# EAGLE design v2.7_Schematic (EAGLE 9.4.2)
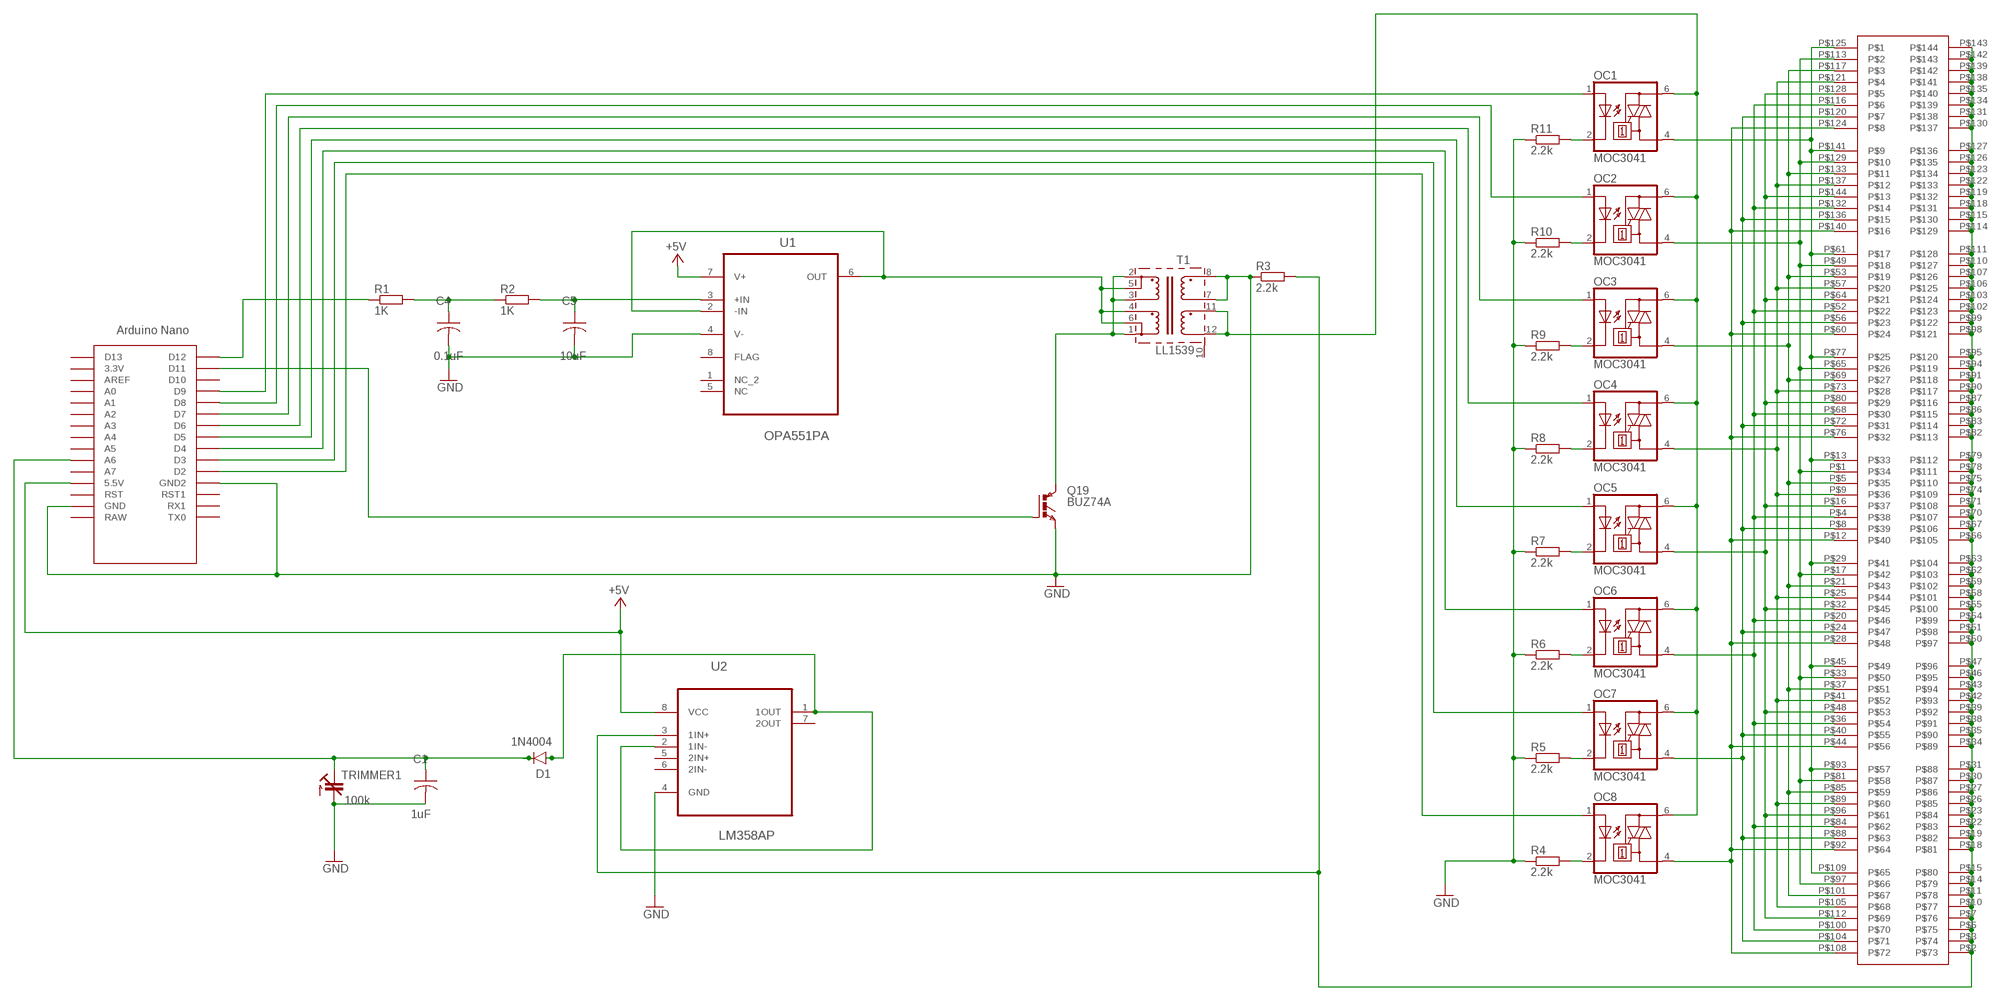
[diagram p0: schematic, sheet 1]

## Parts
C1  1uF  ECA-1HM100  [CAP_RADIAL_2MM]
C4  0.1uF  ECA-1HM100  [CAP_RADIAL_2MM]
C5  10uF  ECA-1HM100  [CAP_RADIAL_2MM]
D1  1N4004  [DO-41]
OC1  MOC3041  [DIL06]
OC2  MOC3041  [DIL06]
OC3  MOC3041  [DIL06]
OC4  MOC3041  [DIL06]
OC5  MOC3041  [DIL06]
OC6  MOC3041  [DIL06]
OC7  MOC3041  [DIL06]
OC8  MOC3041  [DIL06]
Q19  BUZ74A  IGBTTO220AV  [TO220AV]
R1  1K  R-EU_0204/2V  [0204V]
R2  1K  R-EU_0204/2V  [0204V]
R3  2.2k  R-EU_0204/2V  [0204V]
R4  2.2k  R-EU_0204/2V  [0204V]
R5  2.2k  R-EU_0204/2V  [0204V]
R6  2.2k  R-EU_0204/2V  [0204V]
R7  2.2k  R-EU_0204/2V  [0204V]
R8  2.2k  R-EU_0204/2V  [0204V]
R9  2.2k  R-EU_0204/2V  [0204V]
R10  2.2k  R-EU_0204/2V  [0204V]
R11  2.2k  R-EU_0204/2V  [0204V]
T1  LL1539  [LL1539]
TRIMMER1  100k  C-TRIMM3040.452  [CTRIM3040.452]
U1  OPA551PA  [DIP254P762X508-8]
U2  LM358AP  [DIP254P762X508-8]
U$1  NANO  [NANO]
U$2  DOTS_V2  [DOTS_V2]

## Nets
+5V: U1.7(V+) U2.8(VCC) U$1.5V(5.5V)
GND: C1.2 C4.2 C5.2 Q19.E R3.1 R4.1 R5.1 R6.1 R7.1 R8.1 R9.1 R10.1 R11.1 T1.7 T1.8 TRIMMER1.2(A) U1.4(V-) U2.4(GND) U$1.GND U$1.GND1(GND2)
N$1: OC7.2(C) R5.2
N$2: C4.1 R1.2 R2.1
N$3: C5.1 R2.2 U1.3(+IN)
N$4: T1.4 T1.5 T1.6 U1.2(-IN) U1.6(OUT)
N$5: Q19.C T1.1 T1.2 T1.3
N$6: Q19.G U$1.D11
N$7: D1.A U2.1(1OUT) U2.2(1IN-)
N$8: C1.1 D1.C TRIMMER1.1A(E) U$1.A6
N$9: OC8.1(A) U$1.D2
N$10: OC7.1(A) U$1.D3
N$11: OC2.1(A) U$1.D8
N$12: OC6.1(A) U$1.D4
N$13: R1.1 U$1.D12
N$14: OC5.1(A) U$1.D5
N$15: OC4.1(A) U$1.D6
N$16: OC3.1(A) U$1.D7
N$17: R3.2 U2.3(1IN+) U$2.P$2 U$2.P$3 U$2.P$6 U$2.P$7 U$2.P$10 U$2.P$11 U$2.P$14 U$2.P$15 U$2.P$18 U$2.P$19 U$2.P$22 U$2.P$23 U$2.P$26 U$2.P$27 U$2.P$30 U$2.P$31 U$2.P$34 U$2.P$35 U$2.P$38 U$2.P$39 U$2.P$42 U$2.P$43 U$2.P$46 U$2.P$47 U$2.P$50 U$2.P$51 U$2.P$54 U$2.P$55 U$2.P$58 U$2.P$59 U$2.P$62 U$2.P$63 U$2.P$66 U$2.P$67 U$2.P$70 U$2.P$71 U$2.P$74 U$2.P$75 U$2.P$78 U$2.P$79 U$2.P$82 U$2.P$83 U$2.P$86 U$2.P$87 U$2.P$90 U$2.P$91 U$2.P$94 U$2.P$95 U$2.P$98 U$2.P$99 U$2.P$102 U$2.P$103 U$2.P$106 U$2.P$107 U$2.P$110 U$2.P$111 U$2.P$114 U$2.P$115 U$2.P$118 U$2.P$119 U$2.P$122 U$2.P$123 U$2.P$126 U$2.P$127 U$2.P$130 U$2.P$131 U$2.P$134 U$2.P$135 U$2.P$138 U$2.P$139 U$2.P$142 U$2.P$143
N$18: OC1.6(A2) OC2.6(A2) OC3.6(A2) OC4.6(A2) OC5.6(A2) OC6.6(A2) OC7.6(A2) OC8.6(A2) T1.11 T1.12
N$19: OC4.4(A1) U$2.P$9 U$2.P$25 U$2.P$41 U$2.P$57 U$2.P$73 U$2.P$89 U$2.P$105 U$2.P$121 U$2.P$137
N$20: OC1.1(A) U$1.D9
N$21: OC2.4(A1) U$2.P$1 U$2.P$17 U$2.P$33 U$2.P$49 U$2.P$65 U$2.P$81 U$2.P$97 U$2.P$113 U$2.P$129
N$22: OC3.4(A1) U$2.P$5 U$2.P$21 U$2.P$37 U$2.P$53 U$2.P$69 U$2.P$85 U$2.P$101 U$2.P$117 U$2.P$133
N$23: OC5.4(A1) U$2.P$16 U$2.P$32 U$2.P$48 U$2.P$64 U$2.P$80 U$2.P$96 U$2.P$112 U$2.P$128 U$2.P$144
N$24: OC6.4(A1) U$2.P$4 U$2.P$20 U$2.P$36 U$2.P$52 U$2.P$68 U$2.P$84 U$2.P$100 U$2.P$116 U$2.P$132
N$25: OC7.4(A1) U$2.P$8 U$2.P$24 U$2.P$40 U$2.P$56 U$2.P$72 U$2.P$88 U$2.P$104 U$2.P$120 U$2.P$136
N$26: OC8.4(A1) U$2.P$12 U$2.P$28 U$2.P$44 U$2.P$60 U$2.P$76 U$2.P$92 U$2.P$108 U$2.P$124 U$2.P$140
N$27: OC8.2(C) R4.2
N$28: OC1.4(A1) U$2.P$13 U$2.P$29 U$2.P$45 U$2.P$61 U$2.P$77 U$2.P$93 U$2.P$109 U$2.P$125 U$2.P$141
N$29: OC6.2(C) R6.2
N$30: OC5.2(C) R7.2
N$31: OC4.2(C) R8.2
N$32: OC3.2(C) R9.2
N$33: OC2.2(C) R10.2
N$34: OC1.2(C) R11.2
Unconnected: T1.10 U1.1(NC_2) U1.5(NC) U1.8(FLAG) U2.5(2IN+) U2.6(2IN-) U2.7(2OUT) U$1.3.3V U$1.A0 U$1.A1 U$1.A2 U$1.A3 U$1.A4 U$1.A5 U$1.A7 U$1.AREF U$1.D10 U$1.D13 U$1.RAW U$1.RST U$1.RST1 U$1.RX1 U$1.TX0

## Library data of the parts
C1 C4 C5 = Resistor_Capacitor:ECA-1HM100: CAP ALUM 10UF 20% 50V RADIAL Manufacturer's datasheet <https://media.digikey.com/pdf/Data%20Sheets/Panasonic%20Electronic%20Components/ECA-xxM%20Series,TypeA.pdf>; CREATED_BY: PCBLayout.com; DIGIKEY_PART_NUMBER: P5178-ND; MANUFACTURER: Panasonic Electronic Components; MPN: ECA-1HM100; PACKAGE: CAP RADIAL 2MM LS
D1 = Diodes:1N4004: DIODE GEN PURP 400V 1A DO41 Manufacturer's datasheet <https://www.mccsemi.com/pdf/Products/1N4001-1N4007(DO-41).pdf>; CREATED_BY: PCBLayout.com; DIGIKEY_PART_NUMBER: 1N4004MSCT-ND; MANUFACTURER: Micro Commercial Co; MPN: 1N4004; PACKAGE: DO-41
OC1-OC8 = stepper_drivers_etc:MOC3041
Q19 = IGBT:IGBT: IGBT
R1-R11 = resistor:R-EU_: RESISTOR, European symbol
T1 = lundahl:LL1539: LL1539 Transformer
TRIMMER1 = resistor:C-TRIMM: Trimm capacitor
U1 = Texas Instruments_By_element14_Batch_1:OPA551PA: OPERATIONAL AMPLIFIER; MPN: OPA551PA; OC_FARNELL: 4427191; OC_NEWARK: 75C5068; PACKAGE: PDIP; SUPPLIER: Texas Instruments
U2 = Texas Instruments_By_element14_Batch_1:LM358AP: OPERATIONAL AMPLIFIER; MPN: LM358AP; OC_FARNELL: 1459520; OC_NEWARK: 67K0318; PACKAGE: PDIP; SUPPLIER: Texas Instruments
U$1 = Arduino-clone:NANO: Arduino Nano
U$2 = Library:DOTS_V2

## Board
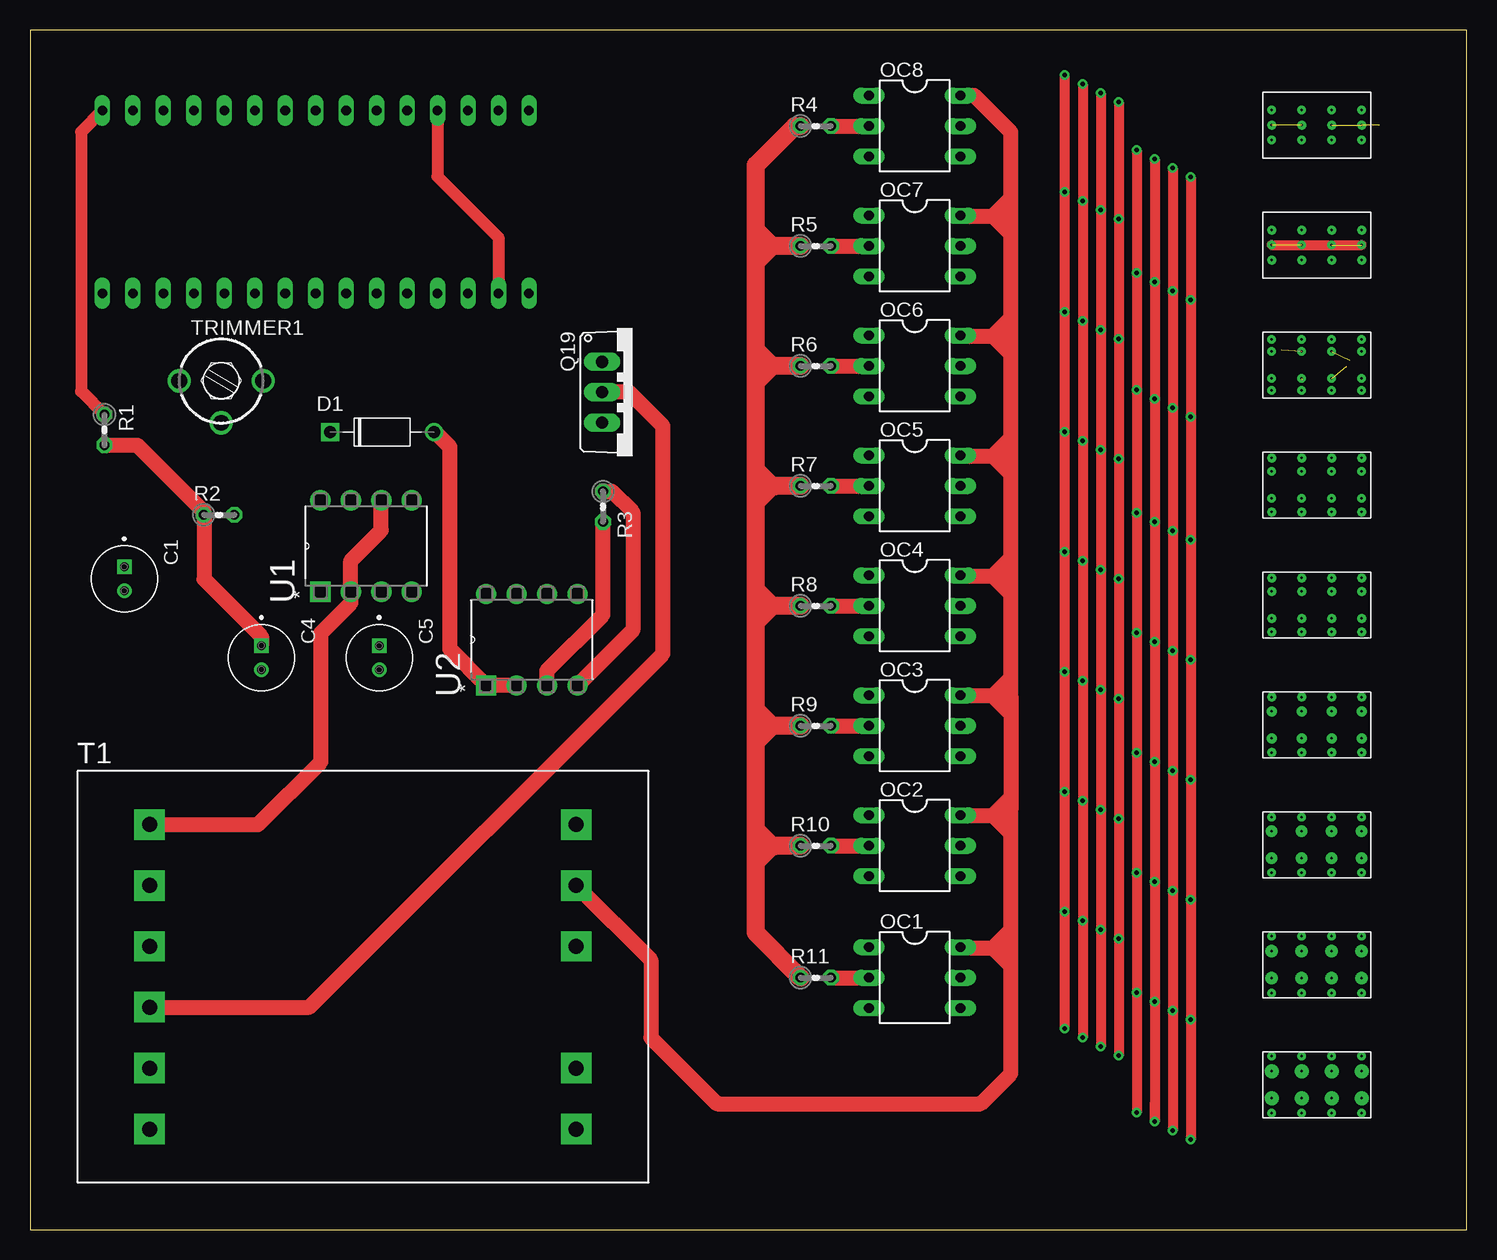
[diagram p1: board, top side]
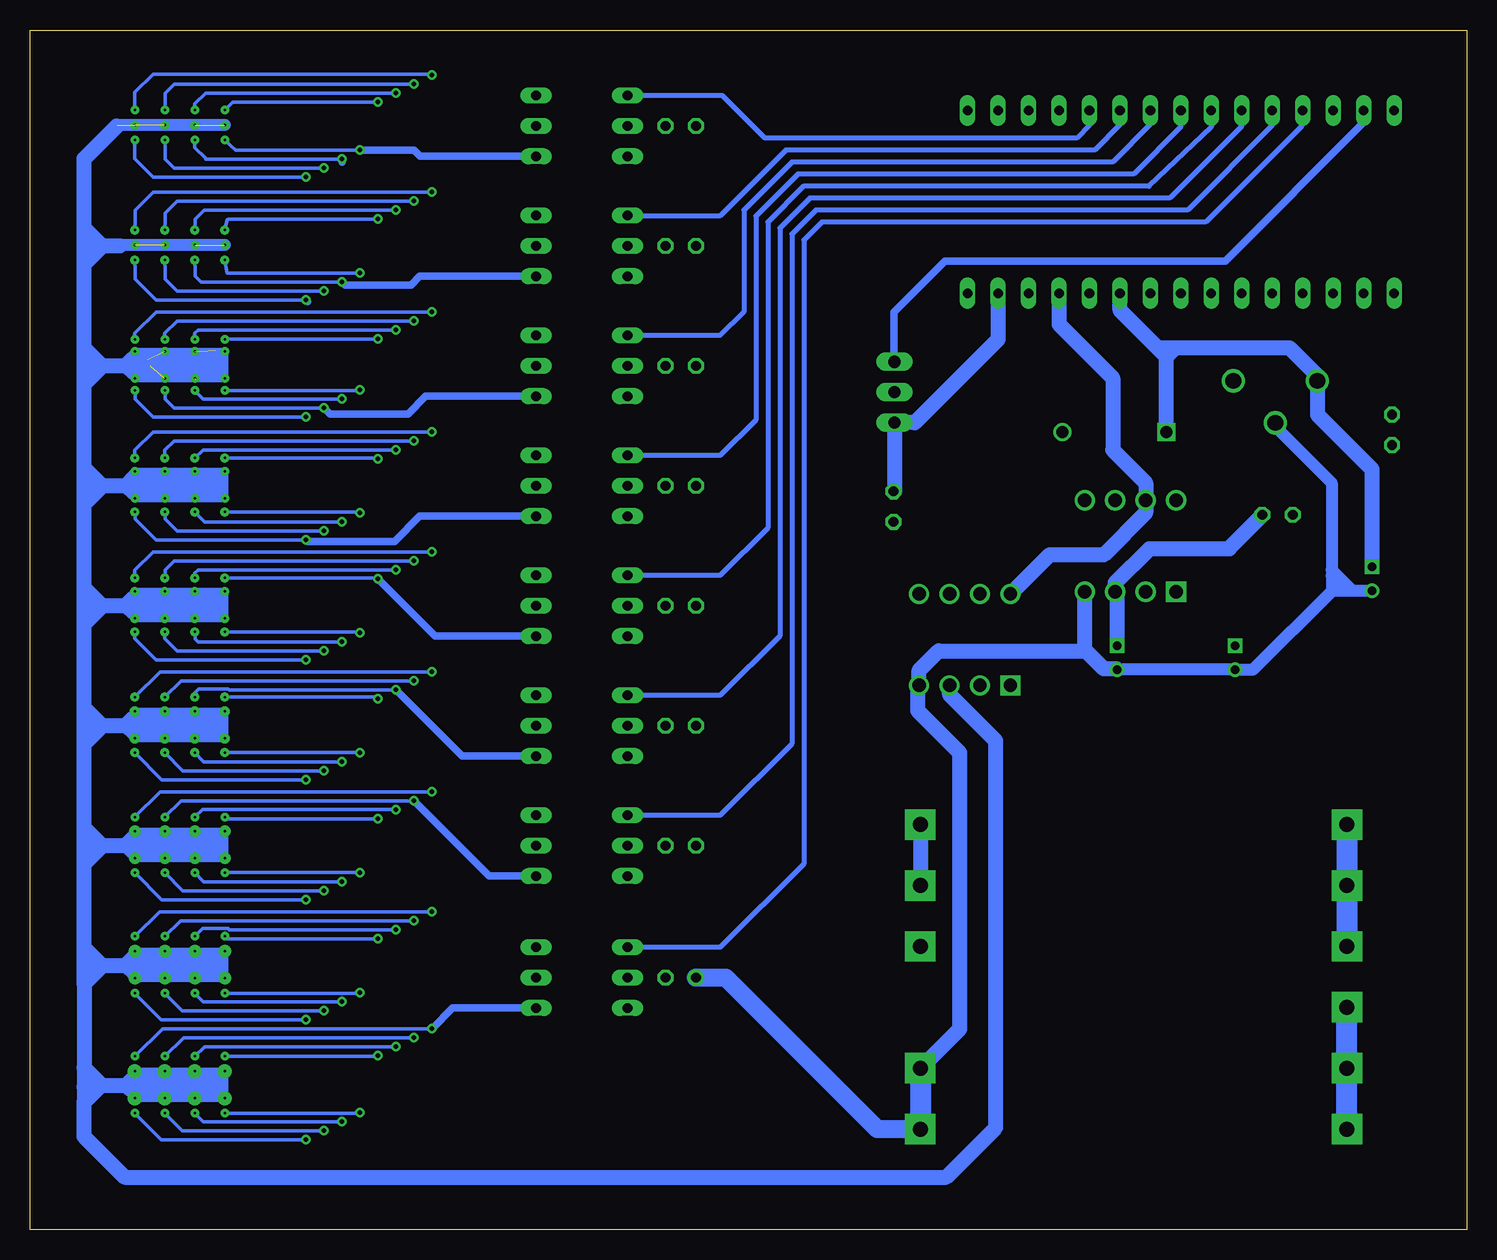
[diagram p2: board, bottom side, seen from below]

Size 119.75 x 100 mm. Coordinates in mm from the lower left corner, seen from the top.
Outline: 0,0 119.75,0 119.75,100 0,100 0,0
Copper layers (1*16): Top 0.035mm / dielectric 1.5mm / Bottom 0.035mm
Design rules "default": minimum track width 6mil, minimum drill 0.35mm, track to track 6mil, track to pad 6mil, pad to pad 6mil, via to via 6mil, smd to smd 6mil, copper to edge 40mil, drill to drill 6mil, minimum pad ring 10mil, minimum via ring 8mil, stop-mask expansion 4mil, vias tented up to drill 0mil, thermal gap 10mil

### Footprints (pad centres in the part's own frame; a part is rotated, then mirrored left to right if it is on the bottom)
CAP_RADIAL_2MM = drill 0.7 pad 1.1 square: 1 -1,0 | drill 0.7 pad 1.1: 2 1,0
DO-41 = drill 1: A 4.325,0 | drill 1 square: C -4.325,0
DIL06 = drill 0.813 long: 1 -2.54,-3.81; 2 0,-3.81; 3 2.54,-3.81; 4 2.54,3.81; 5 0,3.81; 6 -2.54,3.81
TO220AV = drill 1.016 long: C 0,-2.54; E 2.54,-2.54; G -2.54,-2.54
0204V = drill 0.813 octagon: 1 -1.27,0; 2 1.27,0
LL1539 = drill 1.27 pad 2.54 square: 1 -17.78,-12.7; 2 -17.78,-7.62; 3 -17.78,-2.54; 4 -17.78,2.54; 5 -17.78,7.62; 6 -17.78,12.7; 7 17.78,-12.7; 8 17.78,-7.62; 10 17.78,2.54; 11 17.78,7.62; 12 17.78,12.7
CTRIM3040.452 = drill 1.3: 1A -3.5,0; 1B 3.5,0; 2 0,-3.5
DIP254P762X508-8 = drill 1.118 square: 1 -7.62,7.62 | drill 1.118: 2 -7.62,5.08; 3 -7.62,2.54; 4 -7.62,0; 5 0,0; 6 0,2.54; 7 0,5.08; 8 0,7.62
NANO = drill 0.8 long: 3.3V -10.16,24.13; 5V -10.16,-1.27; A0 -10.16,19.05; A1 -10.16,16.51; A2 -10.16,13.97; A3 -10.16,11.43; A4 -10.16,8.89; A5 -10.16,6.35; A6 -10.16,3.81; A7 -10.16,1.27; AREF -10.16,21.59; D2 5.08,1.27; D3 5.08,3.81; D4 5.08,6.35; D5 5.08,8.89; D6 5.08,11.43; D7 5.08,13.97; D8 5.08,16.51; D9 5.08,19.05; D10 5.08,21.59; D11 5.08,24.13; D12 5.08,26.67; D13 -10.16,26.67; GND -10.16,-6.35; GND1 5.08,-1.27; RAW -10.16,-8.89; RST -10.16,-3.81; RST1 5.08,-3.81; RX1 5.08,-6.35; TX0 5.08,-8.89
DOTS_V2 = drill 0.2 pad 0.75: P$1 -2.25,1.25; P$2 -1.125,1.25; P$3 1.125,1.25; P$4 2.25,1.25; P$5 -2.25,-1.25; P$6 -1.125,-1.25; P$7 1.125,-1.25; P$8 2.25,-1.25; P$9 -2.25,-3.75; P$10 -1.125,-3.75; P$11 1.125,-3.75; P$12 2.25,-3.75; P$13 -2.25,3.75; P$14 -1.125,3.75; P$15 1.125,3.75; P$16 2.25,3.75; P$17 7.688,1.25; P$20 12.312,1.25; P$21 7.688,-1.25; P$24 12.312,-1.25; P$25 7.688,-3.75; P$28 12.312,-3.75; P$29 7.688,3.75; P$32 12.312,3.75; P$65 -12.25,1.25; P$68 -7.75,1.25; P$69 -12.25,-1.25; P$72 -7.75,-1.25; P$73 -12.25,-3.75; P$76 -7.75,-3.75; P$77 -12.25,3.75; P$80 -7.75,3.75; P$114 -40,1.25; P$115 -40,1.25; P$118 -40,-1.25; P$119 -40,-1.25; P$122 -40,-3.75; P$123 -40,-3.75; P$127 -40,3.75; P$129 -31.25,1.25; P$132 -28.75,1.25; P$133 -31.25,-1.25; P$136 -28.75,-1.25; P$137 -31.25,-3.75; P$140 -28.75,-3.75; P$141 -31.25,3.75; P$144 -28.75,3.75 | drill 0.2 pad 0.85: P$18 8.875,1.25; P$19 11.125,1.25; P$22 8.875,-1.25; P$23 11.125,-1.25; P$26 8.875,-3.75; P$27 11.125,-3.75; P$30 8.875,3.75; P$31 11.125,3.75 | drill 0.2 pad 0.65: P$33 17.688,1.25; P$36 22.312,1.25; P$37 17.688,-1.25; P$40 22.312,-1.25; P$41 17.688,-3.75; P$44 22.312,-3.75; P$45 17.688,3.75; P$48 22.312,3.75; P$66 -11.125,1.25; P$67 -8.875,1.25; P$70 -11.125,-1.25; P$71 -8.875,-1.25; P$74 -11.125,-3.75; P$75 -8.875,-3.75; P$78 -11.125,3.75; P$79 -8.875,3.75; P$113 -41.25,1.25; P$116 -38.75,1.25; P$117 -41.25,-1.25; P$120 -38.75,-1.25; P$121 -41.25,-3.75; P$124 -38.75,-3.75; P$125 -41.25,3.75; P$128 -38.75,3.75 | drill 0.2 pad 0.95: P$34 18.875,1.25; P$35 21.125,1.25; P$38 18.875,-1.25; P$39 21.125,-1.25; P$42 18.875,-3.75; P$43 21.125,-3.75; P$46 18.875,3.75; P$47 21.125,3.75 | drill 0.2 pad 0.7: P$49 -22.125,1.25; P$52 -17.875,1.25; P$53 -22.125,-1.25; P$56 -17.875,-1.25; P$57 -22.125,-3.75; P$60 -17.875,-3.75; P$61 -22.125,3.75; P$64 -17.875,3.75 | drill 0.2 pad 0.55: P$50 -21.125,1.25; P$51 -18.875,1.25; P$54 -21.125,-1.25; P$55 -18.875,-1.25; P$58 -21.125,-3.75; P$59 -18.875,-3.75; P$62 -21.125,3.75; P$63 -18.875,3.75; P$97 37.625,1.25; P$100 42.375,1.25; P$101 37.625,-1.25; P$104 42.375,-1.25; P$105 37.625,-3.75; P$108 42.375,-3.75; P$109 37.625,3.75; P$112 42.375,3.75 | drill 0.2 pad 0.6: P$81 27.625,1.25; P$84 32.375,1.25; P$85 27.625,-1.25; P$88 32.375,-1.25; P$89 27.625,-3.75; P$92 32.375,-3.75; P$93 27.625,3.75; P$96 32.375,3.75 | drill 0.2 pad 1.05: P$82 28.875,1.25; P$83 31.125,1.25; P$86 28.875,-1.25; P$87 31.125,-1.25; P$90 28.875,-3.75; P$91 31.125,-3.75; P$94 28.875,3.75; P$95 31.125,3.75 | drill 0.2 pad 1.15: P$98 38.875,1.25; P$99 41.125,1.25; P$102 38.875,-1.25; P$103 41.125,-1.25; P$106 38.875,-3.75; P$107 41.125,-3.75; P$110 38.875,3.75; P$111 41.125,3.75 | drill 0.2 pad 0.35: P$126 -40,3.75 | drill 0.2 pad 0.45: P$130 -30,1.25; P$131 -30,1.25; P$134 -30,-1.25; P$135 -30,-1.25; P$138 -30,-3.75; P$139 -30,-3.75; P$142 -30,3.75; P$143 -30,3.75

### Placement (x,y rotation side)
C1  7.86,54.25 270 top
C4  19.3,47.68 270 top
C5  29.11,47.67 270 top
D1  29.35,66.47 0 top
OC1  73.75,21 270 top
OC2  73.75,32 270 top
OC3  73.75,42 270 top
OC4  73.75,52 270 top
OC5  73.75,62 270 top
OC6  73.75,72 270 top
OC7  73.75,82 270 top
OC8  73.75,92 270 top
Q19  50.23,69.8 270 top
R1  6.2,66.67 270 top
R2  15.76,59.58 0 top
R3  47.77,60.26 270 top
R4  65.5,92 0 top
R5  65.5,82 0 top
R6  65.5,72 0 top
R7  65.5,62 0 top
R8  65.5,52 0 top
R9  65.5,42 0 top
R10  65.5,32 0 top
R11  65.5,21 0 top
T1  27.75,21.07 0 top
TRIMMER1  15.94,70.75 0 top
U1  31.83,60.79 90 top
U2  45.64,52.98 90 top
U$1  32.7,88.22 90 top
U$2  107.26,52.07 270 top

### Tracks (layer width: path | path; a pad name or v marks a point on that pad's centre or on a via)
+5V
  Bottom 1.27: U2.8 34.75,56.25 30.25,56.25 26.75,59.75 U1.7 26.75,62.25 29.5,65 29.5,71 33.97,75.47 U$1.5V
GND
  Top 1.016: U$1.GND1 33.97,87.78 39.06,82.69 U$1.GND
  Top 1.27: R3.1 48.52,61.53 50.25,59.8 50.25,49.98 U2.4 | 60.5,83.5 62,82 60.5,80.5 60.5,79.5 | 60.5,73.5 61.75,72.25 61.75,72 61.75,71.75 60.5,70.5 | 62,62 60.5,63.5 | 62.25,62 62,62 | 62,62 60.5,60.5 | 60.5,53.5 62,52 60.5,50.5 60.5,50 | 62,42 60.5,43.5 | 62.25,42 62,42 | 62,42 60.5,40.5 | 62,32 60.5,33.5 | 60.5,30.5 62,32 | 62,32 62.25,32
  Top 1.5: R11.1 60.5,24.73 60.5,30.5 60.5,32 | 60.5,32 60.5,33.5 60.5,40.5 60.5,42.25 | 60.5,42.25 60.5,43.5 60.5,50 60.5,52.25 | 60.5,52.25 60.5,53.5 60.5,60.5 60.5,61.75 | 60.5,61.75 60.5,63.5 60.5,70.5 60.5,72 | 60.5,72 60.5,73.5 60.5,79.5 60.5,81.75 | 60.5,81.75 60.5,83.5 60.5,88.75 63.75,92 R4.1 | R10.1 62.25,32 60.5,32 | R9.1 62.25,42 60.75,42 60.5,42.25 | R8.1 62,52 60.75,52 60.5,52.25 | R7.1 62.25,62 60.75,62 60.5,61.75 | R6.1 61.75,72 60.5,72 | R5.1 62,82 60.75,82 60.5,81.75
  Bottom 1.016: C1.2 9.5,53.25 | 9.5,53.25 10,53.25 | 11.25,55 11.25,62.25 15.94,66.94 TRIMMER1.2 | 11.25,53.25 17.82,46.68 C4.2 C5.2 | 11.25,54.5 11.25,53.25 | 10,53.25 11.25,53.25 | 11.25,55 11.25,54.5 | 11.25,54.5 10,53.25 | 11.25,55 9.5,53.25
  Bottom 1.27: U$1.GND 39.06,74.19 45.99,67.26 Q19.E 47.69,61.61 R3.1 | C5.2 29.19,46.75 30.25,46.75 31.83,48.33 | 31.83,48.33 U1.4 | 31.83,48.33 31.91,48.25 44,48.25 45.64,46.62 U2.4 45.75,45.26 45.75,43.25 42.25,39.75 42.25,16.73 T1.8
  Bottom 1.5: T1.7 49.11,8.37 61.75,21 R11.1 64.25,20.98
  Bottom 1.75: T1.8 T1.7
N$1
  Top 1.27: R5.2 OC7.2
N$2
  Top 1.016: 14.48,59.87 R2.1
  Top 1.25: 14.48,59.87 8.95,65.39 R1.2
  Top 1.27: R2.1 14.5,59.56 14.5,54.23 19.3,49.43 C4.1
N$3
  Bottom 1.27: R2.2 19.75,56.85 19.75,56.75 26.45,56.75 29.29,53.92 U1.3 29.11,52.99 C5.1
N$4
  Top 1.25: U1.2 26.75,55.75 29.29,58.29 U1.6
  Top 1.27: T1.6 19.02,33.77 24.25,39 24.25,49.75 26.75,52.25 U1.2
  Bottom 1.27: 9.97,29 T1.4
  Bottom 1.75: T1.6 9.97,29 | T1.5 T1.4
N$5
  Top 1.27: T1.3 23.27,18.52 52.75,48 52.75,67 49.95,69.8 Q19.C
  Bottom 1.27: 9.97,13 9.97,18 T1.3
  Bottom 1.75: T1.1 9.97,13 | T1.2 9.97,18
N$6
  Bottom 0.406: U$1.D11 8.58,92.3 | 47.75,72.4 Q19.G
  Bottom 0.61: 8.58,92.3 20.12,80.75 43.5,80.75 47.75,76.5 47.75,72.4
N$7
  Top 1.27: U2.2 U2.1 35,48.38 35,65.25 33.78,66.47 D1.A
N$8
  Bottom 1.25: C1.1 7.86,63.36 12.44,67.94 TRIMMER1.1A
  Bottom 1.27: D1.C 25.02,72.78 | U$1.A6 28.89,76.64 25.75,73.5 | 25.02,72.78 25.75,73.5 | 25.02,72.78 24.3,73.5 | 24.3,73.5 14.75,73.5 12.44,71.19 TRIMMER1.1A | 24.3,73.5 25.75,73.5
N$9
  Bottom 0.406: U$1.D2 31.44,92.06 32.5,91 58.5,91 62.04,94.54 OC8.1
N$10
  Bottom 0.406: U$1.D3 28.89,92.11 31,90 56.75,90 62.25,84.5 69.9,84.5 OC7.1
N$11
  Bottom 0.406: U$1.D8 16.2,92.06 23.25,85 54.25,85 56.25,83 56.25,40.5 62.21,34.54 OC2.1
N$12
  Bottom 0.406: U$1.D4 26.35,92.14 29.5,89 56.25,89 60.25,85 60.25,76.5 62.21,74.54 OC6.1
N$13
  Top 1.016: U$1.D12 4.25,91.51 4.25,69.89 R1.1
N$14
  Bottom 0.406: U$1.D5 23.81,91.94 27.75,88 55.75,88 59.25,84.5 59.25,67.5 62.21,64.54 OC5.1
N$15
  Bottom 0.406: U$1.D6 21.27,91.91 26.47,86.97 55.28,86.97 58.25,84 58.25,58.5 62.21,54.54 OC4.1
N$16
  Bottom 0.406: U$1.D7 18.75,93.28 18.75,92 24.75,86 54.75,86 57.25,83.5 57.25,49.5 62.21,44.54 OC3.1
N$17  (9 unrouted)
  Top 0.813: U$2.P$139 U$2.P$143
  Top 1.27: U2.3 43.1,46.6 47.75,51.25 47.75,58.98 R3.2
  Bottom 0.152: 106,43.32 U$2.P$22 U$2.P$18 | U$2.P$31 U$2.P$19 U$2.P$23 U$2.P$27 | U$2.P$15 U$2.P$3 | U$2.P$7 U$2.P$11 | U$2.P$6 U$2.P$2 110.25,53.32 | 104.25,63.32 U$2.P$70 U$2.P$66 | U$2.P$79 | 110.75,70.82 U$2.P$63
  Bottom 0.305: 106,70.82 U$2.P$59 103.51,72 | 103.51,72 103.51,72.5 | 103.51,72.5 U$2.P$58 104.33,73.32 103.51,72.5 | 111.01,92 U$2.P$127 | 111.01,72.81 U$2.P$62 110.5,73.32 | 111.01,72 111.01,72.5 | 111.01,72 U$2.P$63 | 110.5,73.32 110.25,73.32 110.25,72.5 | U$2.P$74 103.51,63.25 | U$2.P$74 103.51,62 | 103.51,62 U$2.P$75 | 110.5,63.32 U$2.P$78 111.01,62.75 | 110.5,63.32 110.25,63.32 | 110.25,63.32 U$2.P$66 104.25,63.32 | 104.25,63.32 U$2.P$74 | 111.01,62.75 111.01,62 | 111.01,62 U$2.P$79 | 103.51,52.75 U$2.P$10 104.25,53.32 | 103.51,52.75 103.51,52.5 | 103.51,52.5 103.51,52 | 103.51,52 U$2.P$11 | 110.5,53.32 U$2.P$14 111.01,52 | 110.5,53.32 110.25,53.32 | 110.25,53.32 U$2.P$6 104.25,53.32 | U$2.P$15 111.01,52 | 103.51,42.75 U$2.P$26 104.25,43.32 | 103.51,42.75 103.51,42 | 103.51,42 103.51,41 U$2.P$27 | 104.25,43.32 106,43.32 U$2.P$18 110.25,43.32 | 110.25,43.32 110.5,43.32 | 110.5,43.32 U$2.P$30 111.01,42.75 | 111.01,42.75 111.01,42 | 111.01,42 U$2.P$31 | 103.51,32 U$2.P$42 108.5,33.32 U$2.P$46 111.01,32 | 103.51,32 U$2.P$43 | 111.01,32 U$2.P$47 | U$2.P$94 111.01,22 | U$2.P$95 111.01,22 | U$2.P$91 103.51,22 | 103.51,22 U$2.P$90 | U$2.P$106 103.51,12 | 103.51,11.5 U$2.P$107 103.75,10.82 | 103.51,11.5 103.51,12 | 103.75,10.82 104.18,10.82 | 104.18,10.82 110.25,10.82 | U$2.P$111 111.01,11.5 | 111.01,11.5 111.01,12 | 111.01,12 111.01,12.5 | 111.01,12.5 111.01,12.75 | 111.01,12.75 U$2.P$110 | 104.43,13.32 110.19,13.32 | 110.44,13.32 U$2.P$110 | 103.51,12 103.75,12 | 103.75,12 104.75,12 104.25,11.5 103.88,11.12 | 103.51,22 103.75,22 104.75,22 | 109.75,22 110.75,22 111.01,22 | 103.51,32 104.75,32 | 109.75,32 110,32 111.01,32 | 103.51,42 104.75,42 | 110.26,42 111.01,42 | 103.51,52 104.25,52 104.26,52
  Bottom 0.305: 110.75,52 110.25,52 109.75,52 110.25,52.5 | 110.75,52 111.01,52 | 103.51,62 104,62 104.25,62 104.75,62 | 111.01,62 110.75,62 110.25,62 109.75,62 110.25,62.5 | 103.51,72 104.25,72 104.75,72 | 110.51,72 111.01,72 | U$2.P$106 103.75,13.08 103.75,12 | 104.43,13.32 104.75,13 104.32,13 | U$2.P$106 103.75,13.32 | 103.75,13.32 104,13.32 | 104,13.32 104.43,13.32 | U$2.P$106 103.83,13 104.07,13 | 104.32,13 104,13.32 | 104.32,13 104.07,13 | 104.07,13 103.75,13.32 | 103.88,11.12 103.75,11 | 103.75,11 103.75,10.82 | 103.51,11.5 103.75,11.26 103.75,11 | 104.18,10.82 103.88,11.12 | 110.19,13.32 110.44,13.32 | 110.44,13.32 110.75,13.01 | 110.75,13.01 111.01,12.75 | 110.19,13.32 111.01,12.5 | U$2.P$110 111.01,13.26 110.75,13.01 | 109.75,12 110.62,12 111.01,12 | 110.25,10.82 110.47,11.04 | 110.47,11.04 110.72,11.29 | 110.72,11.29 110.93,11.5 111.01,11.5 | U$2.P$111 110.72,11.12 110.72,11.29 | U$2.P$111 110.25,10.82 | U$2.P$111 110.68,10.82 110.47,11.04 | 110.25,42.5 110.25,43.32 | 110.5,43.32 110.5,42.75 109.75,42 110.26,42 | 110.26,42 111.01,42.75 | 104.25,42.58 103.68,42.58 103.51,42.75 | 103.91,42.91 103.91,42.98 104.25,43.32 | 104.25,53.32 104.25,52.5 104.75,52 104.26,52 | 104.04,52.79 103.75,52.5 103.51,52.5 | 104.26,52 103.51,52.75 | 110.5,52.75 110.59,52.84 110.59,52.91 110.75,52.75 110.75,52 | 110.25,52.5 110.25,53.32 | 110.25,52.5 110.5,52.75 | 110.5,52.75 110.5,53.32 | 104.25,62.75 104.25,63.32 | 110.44,62.75 110.25,62.94 | 110.25,62.94 110.25,63.32 | 110.47,62.78 110.98,62.78 111.01,62.75 | 110.25,62.5 110.25,62.94 | 110.25,62.5 110.5,62.75 110.5,63.32 | 110.25,72.5 109.75,72 110.26,72 | 111.01,72.5 111.01,72.75 | 111.01,72.75 111.01,72.81
  Bottom 0.305: 111.01,72.81 110.53,73.28 | 110.53,73.28 110.5,73.32 | 110.26,72 110.51,72 | 110.51,72 111.01,72.5 | 110.26,72 111.01,72.75 | 110.25,72.5 110.53,72.78 110.53,73.28
  Bottom 0.61: U$2.P$90 103.83,23 104.75,23 | U$2.P$90 103.75,23.08 103.75,22 | U$2.P$86 105.75,23.06 105.75,22 105.75,21.08 U$2.P$87 | U$2.P$82 108.75,23.08 108.75,23 110.69,23 U$2.P$94 | U$2.P$94 111.01,23.26 109.75,22 109.69,22 U$2.P$83 | U$2.P$95 110.75,21.08 110.75,22 | U$2.P$91 104.69,22 104.75,22 | U$2.P$106 104.75,12.08 104.75,12.06 | U$2.P$102 104.75,12.06 | 104.75,12.06 104.75,12 | U$2.P$103 105.75,11.08 105.75,12 | U$2.P$99 109.69,12 109.75,12 | U$2.P$111 109.83,12 109.75,12 | U$2.P$110 109.75,12.06 | 109.75,12.06 109.75,12 | U$2.P$107 104.19,11.5 104.25,11.5 | U$2.P$98 109.75,12.08 109.75,12.06 | 103.91,32.91 U$2.P$42 | 106.01,32.74 105.84,32.91 103.91,32.91 | 106.01,31.26 106,31.25 103.94,31.25 U$2.P$43 | 103.91,32.91 103.91,32.84 104.75,32 | U$2.P$46 110.59,32.91 | 110.59,32.91 110,32.31 | 110,32.31 110,32 | 110.59,32.84 110.59,32.91 | 109.75,32 110.59,32.84 | 108.25,32 109.09,32.84 110,32.84 | 110,32.84 110.59,32.84 | 106.75,32 107.18,32 108.5,33.32 | U$2.P$35 110,32.31 | 110,32.31 110,32.84 | U$2.P$34 108.93,32.91 110.59,32.91 | U$2.P$47 110.59,31.23 110.59,32.84 | U$2.P$38 106.01,32.74 | 106.01,32.74 106.75,32 | U$2.P$39 106.01,31.26 | 106.01,31.26 106.75,32 | U$2.P$26 103.91,42.91 104.25,42.58 104.25,41.5 103.57,40.82 U$2.P$27 U$2.P$31 | U$2.P$23 106.01,43.31 106,43.32 | U$2.P$19 U$2.P$18 | U$2.P$30 111.01,43.26 110.25,42.5 | 110.25,42.5 110.25,41.58 U$2.P$31 | 109.75,42 110.25,42.5 | U$2.P$58 104.25,72.58 104.25,72 104.25,71.56 U$2.P$59 | U$2.P$63 109.83,72 109.75,72 | 110,72.5 110.19,72.5 U$2.P$62 | U$2.P$79 110.25,61.58 110.25,62 | U$2.P$78 110.47,62.78 110.44,62.75 104.25,62.75 104.01,62.75 103.51,63.25 | U$2.P$74 104,62.83 104,62
  Bottom 0.61: U$2.P$75 104.25,61.56 104.25,62 | U$2.P$11 104.25,51.56 104.25,52 | U$2.P$15 110.25,51.58 110.25,52 | 110.59,52.91 U$2.P$14 | U$2.P$10 104.04,52.79 104.75,52.08 104.75,52 | U$2.P$67 U$2.P$66 | U$2.P$7 U$2.P$6 | U$2.P$14 U$2.P$15 | U$2.P$14 112.25,52.08 112.25,52 112.19,52 U$2.P$15 | U$2.P$78 U$2.P$79 | U$2.P$78 111.01,63.24 112.25,62 112.19,62 U$2.P$79 | U$2.P$30 U$2.P$31 | U$2.P$30 112.25,42.08 112.25,42 112.19,42 U$2.P$31 | U$2.P$46 U$2.P$47 | U$2.P$46 112.25,32.08 112.25,32.06 | 112.25,32.06 112.25,32 | U$2.P$47 112.25,32.06 | U$2.P$94 112.25,22.08 112.25,22 112.19,22 U$2.P$95 | U$2.P$94 U$2.P$95 | U$2.P$110 U$2.P$111 | U$2.P$110 111.51,12.7 112.28,12 112.19,12 U$2.P$111 | U$2.P$62 U$2.P$63 | U$2.P$62 112.33,72 | 112.33,72 112.75,72 | U$2.P$63 112.19,72 112.33,72 | 112.25,82.08 112.25,82 112.19,82 | U$2.P$71 U$2.P$67 | U$2.P$67 U$2.P$79 | U$2.P$79 U$2.P$75 | U$2.P$74 U$2.P$78 | U$2.P$58 U$2.P$62 | U$2.P$63 U$2.P$59 | U$2.P$10 U$2.P$14 | U$2.P$15 U$2.P$11 | U$2.P$26 U$2.P$30 | U$2.P$42 U$2.P$46 | U$2.P$47 U$2.P$43 | U$2.P$90 U$2.P$94 | U$2.P$95 U$2.P$91 | U$2.P$106 U$2.P$110 | U$2.P$111 U$2.P$107 | U$2.P$26 103.51,41 | U$2.P$10 U$2.P$11 | U$2.P$74 U$2.P$75 | U$2.P$58 U$2.P$59 | U$2.P$90 U$2.P$91 | U$2.P$106 U$2.P$107 | U$2.P$42 U$2.P$43
  Bottom 1.016: U$2.P$139 112.18,82.07 112.25,82 | U$2.P$123 112.46,92.07 112.53,92
  Bottom 1.25: 115.25,20.5 115.25,13.5 | 115.25,13.5 115.25,11.88 | 115.25,20.5 115.25,22 | 115.25,22 115.25,23.5 | 115.25,23.5 115.25,30.5 | 115.25,30.5 115.25,32.5 | 115.25,32.5 115.25,33.5 | 115.25,33.5 115.25,40.5 | 115.25,40.5 115.25,42 | 115.25,42 115.25,43.5 | 115.25,43.5 115.25,50.5 | 115.25,50.5 115.25,52 | 115.25,52 115.25,53.5 | 115.25,53.5 115.25,60.5 | 115.25,60.5 115.25,62 | 110.75,22 112.25,22 113.75,22 | 115.25,22 113.75,22 | 111.01,32 112.25,32 113.75,32 | 113.75,32 114.75,32 115.25,32.5 | 109.75,42 112.25,42 113.75,42 | 115.25,42 113.75,42 | 111.01,52 112.25,52 113.75,52 | 115.25,52 113.75,52 | 110.75,62 112.25,62 113.75,62 | 115.25,62 113.75,62 | 109.75,72 112.75,72 113.75,72 | 114.75,72 113.75,72 | 112.53,92 115.25,89.28 115.25,83.5 | 115.25,62 115.25,63.5 | 115.25,63.5 115.25,70.5 | 115.25,70.5 115.25,73.5 | 115.25,73.5 115.25,80.5 | 115.25,80.5 115.25,83.5 | 112.25,82 113.75,82 | 114.75,82 113.75,82 | 113.75,22 115.25,23.5 | 113.75,22 115.25,20.5 | 113.75,32 115.25,33.5 | 113.75,32 115.25,30.5 | 113.75,42 115.25,43.5 | 113.75,42 115.25,40.5 | 113.75,52 115.25,53.5 | 113.75,52 115.25,50.5 | 113.75,62 115.25,63.5 | 113.75,62 115.25,60.5 | 113.75,72 115.25,73.5 | 113.75,72 115.25,70.5 | 113.75,82 115.25,83.5 | 113.75,82 115.25,80.5 | 115.25,11.88 115.25,10.62 | 115.25,10.62 115.25,7.75 111.88,4.38 43.38,4.38 39.25,8.5 39.25,40.75 43.1,44.6 U2.3 | 110.62,12 113.75,12 | 113.88,12 115.12,12 115.25,11.88 | 115.25,13.5 113.75,12 | 113.75,12 113.88,12 | 113.88,12 115.25,10.62
  Bottom 2.54: 104.75,12 105.75,12 109.75,12 | 104.75,22 105.75,22 109.75,22 | 109.75,32 108.25,32 106.75,32 104.75,32 | 104.75,42 109.75,42 | 104.75,52 109.75,52 | 104.75,62 109.75,62 | 104.75,72 109.75,72
N$18
  Top 1.25: T1.11 51.75,22.46 51.75,16 57.25,10.5 79.25,10.5 81.75,13 81.75,22 | 81.75,22 81.75,23.5 | 81.75,23.5 81.75,25 | 81.75,25 81.75,33.04 | 81.75,33.04 81.75,35 | 81.75,44.5 81.75,43 | 81.75,43 81.75,36 | 81.75,36 81.75,35 | 81.75,44.5 81.75,46 | 81.75,46 81.75,53 | 81.75,53 81.75,54.5 | 81.75,54.5 81.75,56 | 81.75,56 81.75,63 | 81.75,63 81.75,64.5 | 81.75,64.5 81.75,66 | 81.75,66 81.75,73 | 81.75,73 81.75,74.5 | 81.75,74.5 81.75,76 | 81.75,76 81.75,83 | 81.75,83 81.75,84.5 | 81.75,84.5 81.75,86 | 81.75,86 81.75,91.5 78.71,94.54 OC8.6 | OC7.6 77.6,84.5 80.25,84.5 | 81.75,84.5 80.25,84.5 | OC6.6 77.6,74.5 80.25,74.5 | 80.25,74.5 81.75,74.5 | 80.25,74.5 81.75,76 | 80.25,84.5 81.75,86 | 80.25,84.5 81.75,83 | 80.25,74.5 81.75,73 | 81.75,64.5 80.25,64.5 | 80.25,64.5 77.6,64.5 OC5.6 | 81.75,54.5 80.25,54.5 | 80.25,54.5 77.6,54.5 OC4.6 | 81.75,44.5 80.25,44.5 | 80.25,44.5 77.6,44.5 OC3.6 | 81.75,35 81.29,34.54 80.25,34.54 | OC2.6 80.25,34.54 | 81.75,23.5 80.25,23.5 | 80.25,23.5 77.6,23.5 OC1.6 | 80.25,64.5 81.75,66 | 80.25,64.5 81.75,63 | 80.25,54.5 81.75,56 | 80.25,54.5 81.75,53 | 81.75,46 80.25,44.5 | 80.25,44.5 81.75,43 | 80.25,34.54 81.71,36 81.75,36 | 80.25,34.54 81.75,33.04 | 80.25,23.5 81.75,25 | 80.25,23.5 81.75,22
  Bottom 1.25: T1.12 T1.11
N$19  (via drill 0.35 pad 0.55)
  Top 0.813: v90.75,94 v90.75,84.25 v90.75,74.25 v90.75,64.25 v90.75,54.25 v90.75,44.25 v90.75,34.25 v90.75,24.25 v90.75,14.5
  Bottom 0.305: U$2.P$121 102.88,94 v90.75,94 | U$2.P$137 103.31,84.19 103.25,84.25 v90.75,84.25 | U$2.P$57 103.46,74.25 v90.75,74.25 | U$2.P$73 90.82,64.32 v90.75,64.25 | U$2.P$9 90.82,54.32 v90.75,54.25 | U$2.P$25 90.88,44.38 v90.75,44.25 | U$2.P$41 103.38,34.25 v90.75,34.25 | U$2.P$89 103.31,24.25 v90.75,24.25 | U$2.P$105 90.81,14.45 v90.75,14.5
  Bottom 0.61: OC4.4 85.96,49.46 v90.75,54.25
N$20
  Bottom 0.406: U$1.D9 13.75,93.2 13.75,92 21.75,84 53.75,84 55.25,82.5 55.25,30.5 62.21,23.54 OC1.1
N$21  (via drill 0.35 pad 0.55)
  Top 0.813: v87.75,95.5 v87.75,85.75 v87.75,75.75 v87.75,65.75 v87.75,55.75 v87.75,45.75 v87.75,35.75 v87.75,25.75 v87.75,16
  Bottom 0.305: U$2.P$113 108.5,94.08 108.5,94.75 107.75,95.5 v87.75,95.5 | U$2.P$129 108.5,84.2 108.5,84.75 107.5,85.75 v87.75,85.75 | U$2.P$49 108.51,74.74 107.5,75.75 v87.75,75.75 | U$2.P$65 108.51,64.99 107.75,65.75 v87.75,65.75 | U$2.P$1 108.5,55 107.75,55.75 v87.75,55.75 | U$2.P$17 107.14,45.75 v87.75,45.75 | U$2.P$33 107.14,35.75 v87.75,35.75 | U$2.P$81 107.21,25.75 v87.75,25.75 | U$2.P$97 106.96,16 v87.75,16
  Bottom 0.61: OC2.4 81.46,29.46 84.12,32.12 v87.75,35.75
N$22  (via drill 0.35 pad 0.55)
  Top 0.813: v89.25,94.75 v89.25,85 v89.25,75 v89.25,65 v89.25,55 v89.25,45 v89.25,35 v89.25,25 v89.25,15.25
  Bottom 0.305: U$2.P$117 106.01,93.85 105.11,94.75 105,94.75 v89.25,94.75 | U$2.P$133 106,84.2 106,84.25 105.25,85 v89.25,85 | U$2.P$53 106.01,74.74 105.75,75 v89.25,75 | U$2.P$69 105.33,65 v89.25,65 | U$2.P$5 106.01,54.74 105.75,55 v89.25,55 | U$2.P$21 106.01,44.74 105.69,45.06 103.23,45.06 103.17,45 v89.25,45 | v89.25,35 89.29,35.04 105.35,35.04 U$2.P$37 | v89.25,25 103.13,25 103.24,25.1 105.35,25.1 U$2.P$85 | U$2.P$101 105.21,15.25 v89.25,15.25
  Bottom 0.61: OC3.4 83.71,39.46 v89.25,45
N$23  (via drill 0.35 pad 0.55)
  Top 0.813: v96.75,87.75 v96.75,77.5 v96.75,67.75 v96.75,57.5 v96.75,47.5 v96.75,37.5 v96.75,27.5 v96.75,17.5 v96.75,7.5
  Bottom 0.305: U$2.P$128 111.01,89.26 109.5,87.75 v96.75,87.75 | U$2.P$144 111,79.94 111,79.25 109.25,77.5 v96.75,77.5 | U$2.P$64 111,69.25 109.5,67.75 v96.75,67.75 | U$2.P$80 111,59.25 109.25,57.5 v96.75,57.5 | U$2.P$16 111.01,49.26 109.25,47.5 v96.75,47.5 | U$2.P$32 108.75,37.5 v96.75,37.5 | U$2.P$112 108.81,7.5 v96.75,7.5 | U$2.P$48 108.75,27.5 v96.75,27.5 | U$2.P$96 108.81,17.5 v96.75,17.5
  Bottom 0.61: 96.59,77.33 v96.75,77.5 | v96.75,57.5 96.62,57.38 89.38,57.38 87.29,59.46 OC5.4
N$24  (via drill 0.35 pad 0.55)
  Top 0.813: v95.25,88.5 v95.25,78.25 v95.25,68.5 v95.25,58.25 v95.25,48.25 v95.25,38.25 v95.25,28.25 v95.25,18.25 v95.25,8.25
  Bottom 0.305: U$2.P$116 108.5,90.06 108.5,89.25 107.75,88.5 v95.25,88.5 | U$2.P$132 108.5,79.94 108.5,79.25 107.5,78.25 v95.25,78.25 | U$2.P$52 108.5,69.25 107.75,68.5 v95.25,68.5 | U$2.P$68 108.5,59.25 107.5,58.25 v95.25,58.25 | U$2.P$4 108.51,49.26 107.5,48.25 v95.25,48.25 | U$2.P$20 107,38.25 v95.25,38.25 | U$2.P$100 107.06,8.25 v95.25,8.25 | U$2.P$36 107,28.25 v95.25,28.25 | U$2.P$84 107.06,18.25 v95.25,18.25
  Bottom 0.61: OC6.4 86.79,69.46 88.25,68 94.75,68 v95.25,68.5
N$25  (via drill 0.35 pad 0.55)
  Top 0.813: v93.75,89.25 v93.75,79 v93.75,69.25 v93.75,59 v93.75,49 v93.75,39 v93.75,29 v93.75,19 v93.75,9 93.75,10.5
  Bottom 0.305: U$2.P$120 106.01,90.19 105.12,89.31 105.12,89.25 v93.75,89.25 | U$2.P$136 106,79.94 106,79.5 105.5,79 v93.75,79 | U$2.P$56 105.31,69.25 v93.75,69.25 | U$2.P$72 105.19,59 v93.75,59 | U$2.P$8 106,49.25 105.75,49 v93.75,49 | U$2.P$24 105.25,39 v93.75,39 | U$2.P$104 105.31,9 v93.75,9 | U$2.P$40 105.25,29 v93.75,29 | U$2.P$88 105.31,19 v93.75,19
  Bottom 0.61: 93.75,89 v93.75,89.25 | OC7.4 87.29,79.46 88,78.75 93.5,78.75 v93.75,79
N$26  (via drill 0.35 pad 0.55)
  Top 0.813: v92.25,90 v92.25,79.75 v92.25,70 v92.25,59.75 v92.25,49.75 v92.25,39.75 v92.25,29.75 v92.25,19.75 v92.25,9.75
  Bottom 0.305: U$2.P$124 102.62,90 v92.25,90 | U$2.P$140 103.31,79.75 v92.25,79.75 | U$2.P$60 92.31,69.94 v92.25,70 | U$2.P$76 92.32,59.82 v92.25,59.75 | U$2.P$12 92.32,49.82 v92.25,49.75 | U$2.P$28 v92.26,39.76 v92.25,39.75 | U$2.P$108 92.31,9.7 v92.25,9.75 | U$2.P$44 v92.26,29.76 v92.25,29.75 | U$2.P$92 92.31,19.7 v92.25,19.75
  Bottom 0.61: OC8.4 87.21,89.46 87.75,90 v92.25,90
N$27
  Top 1.27: R4.2 OC8.2
N$28  (via drill 0.35 pad 0.55)
  Top 0.813: v86.25,16.75 v86.25,26.5 v86.25,36.5 v86.25,46.5 v86.25,56.5 v86.25,66.5 v86.25,76.5 v86.25,86.5 v86.25,96.25
  Bottom 0.305: U$2.P$141 111,84.2 111,85 109.5,86.5 v86.25,86.5 | U$2.P$125 111.01,94.82 109.5,96.33 86.33,96.33 v86.25,96.25 | U$2.P$61 111.01,74.74 109.25,76.5 v86.25,76.5 | U$2.P$77 111.01,64.99 109.5,66.5 v86.25,66.5 | U$2.P$13 111.01,54.99 109.5,56.5 v86.25,56.5 | U$2.P$29 108.89,46.5 v86.25,46.5 | U$2.P$45 108.89,36.5 v86.25,36.5 | U$2.P$93 108.96,26.5 v86.25,26.5 | U$2.P$109 108.71,16.75 v86.25,16.75
  Bottom 0.61: OC1.4 84.21,18.46 84.46,18.46 84.54,18.46 v86.25,16.75
N$29
  Top 1.27: R6.2 OC6.2
N$30
  Top 1.27: R7.2 OC5.2
N$31
  Top 1.27: R8.2 OC4.2
N$32
  Top 1.27: R9.2 OC3.2
N$33
  Top 1.27: R10.2 OC2.2
N$34
  Top 1.27: R11.2 OC1.2